# Altium schematic sheet 08-Clock.SchDoc
size A3; SheetNumber: 4; SheetTotal: 7
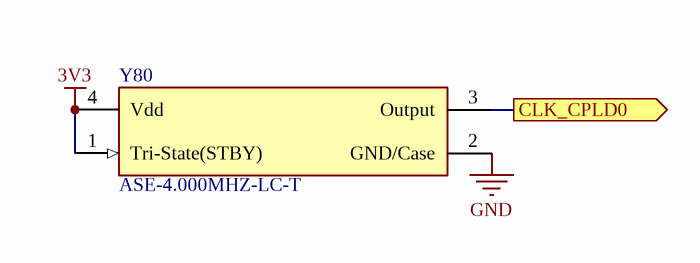
[diagram p0: 08-Clock.SchDoc]

## Parts
Y80  ASE-4.000MHZ-LC-T  [ASE-4.000MHZ-LC-T_HandSoldering]

## Ports
CLK_CPLD0 (out)

## Nets
3V3: Y80.1(Tri-State(STBY)) Y80.4(Vdd)
GND: Y80.2(GND/Case)
CLK_CPLD0: Y80.3(Output) ; port CLK_CPLD0

## Notes on the sheet
- Title:
- Date:
- SVN:
- Ver:
- Sheet Size:
- A3
- Sheet Name:
- OF
- Checked By:
- Drawn By:
- Damian Szczypior
- Rev:
- Alle Rechte vorbehalten. Kopien ohne Erlaubnis der X2E GmbH sind nicht gestattet. Dieses Dokument darf ohne die Erlaubnis der X2E GmbH nicht an Dritte (auch nicht in Auszügen) weitergegeben werden .
- Sheet:

## Library data of the parts
Y80 = OC_SMD_4MHz_3V3_ASE: XTAL OSC XO 4.0000MHZ CMOS SMD; ComponentLink1Description: Datasheet; ComponentLink1URL: https://abracon.com/Oscillators/ASEseries.pdf